# EAGLE design class-d-amp-3-5-mm (EAGLE 5.10)
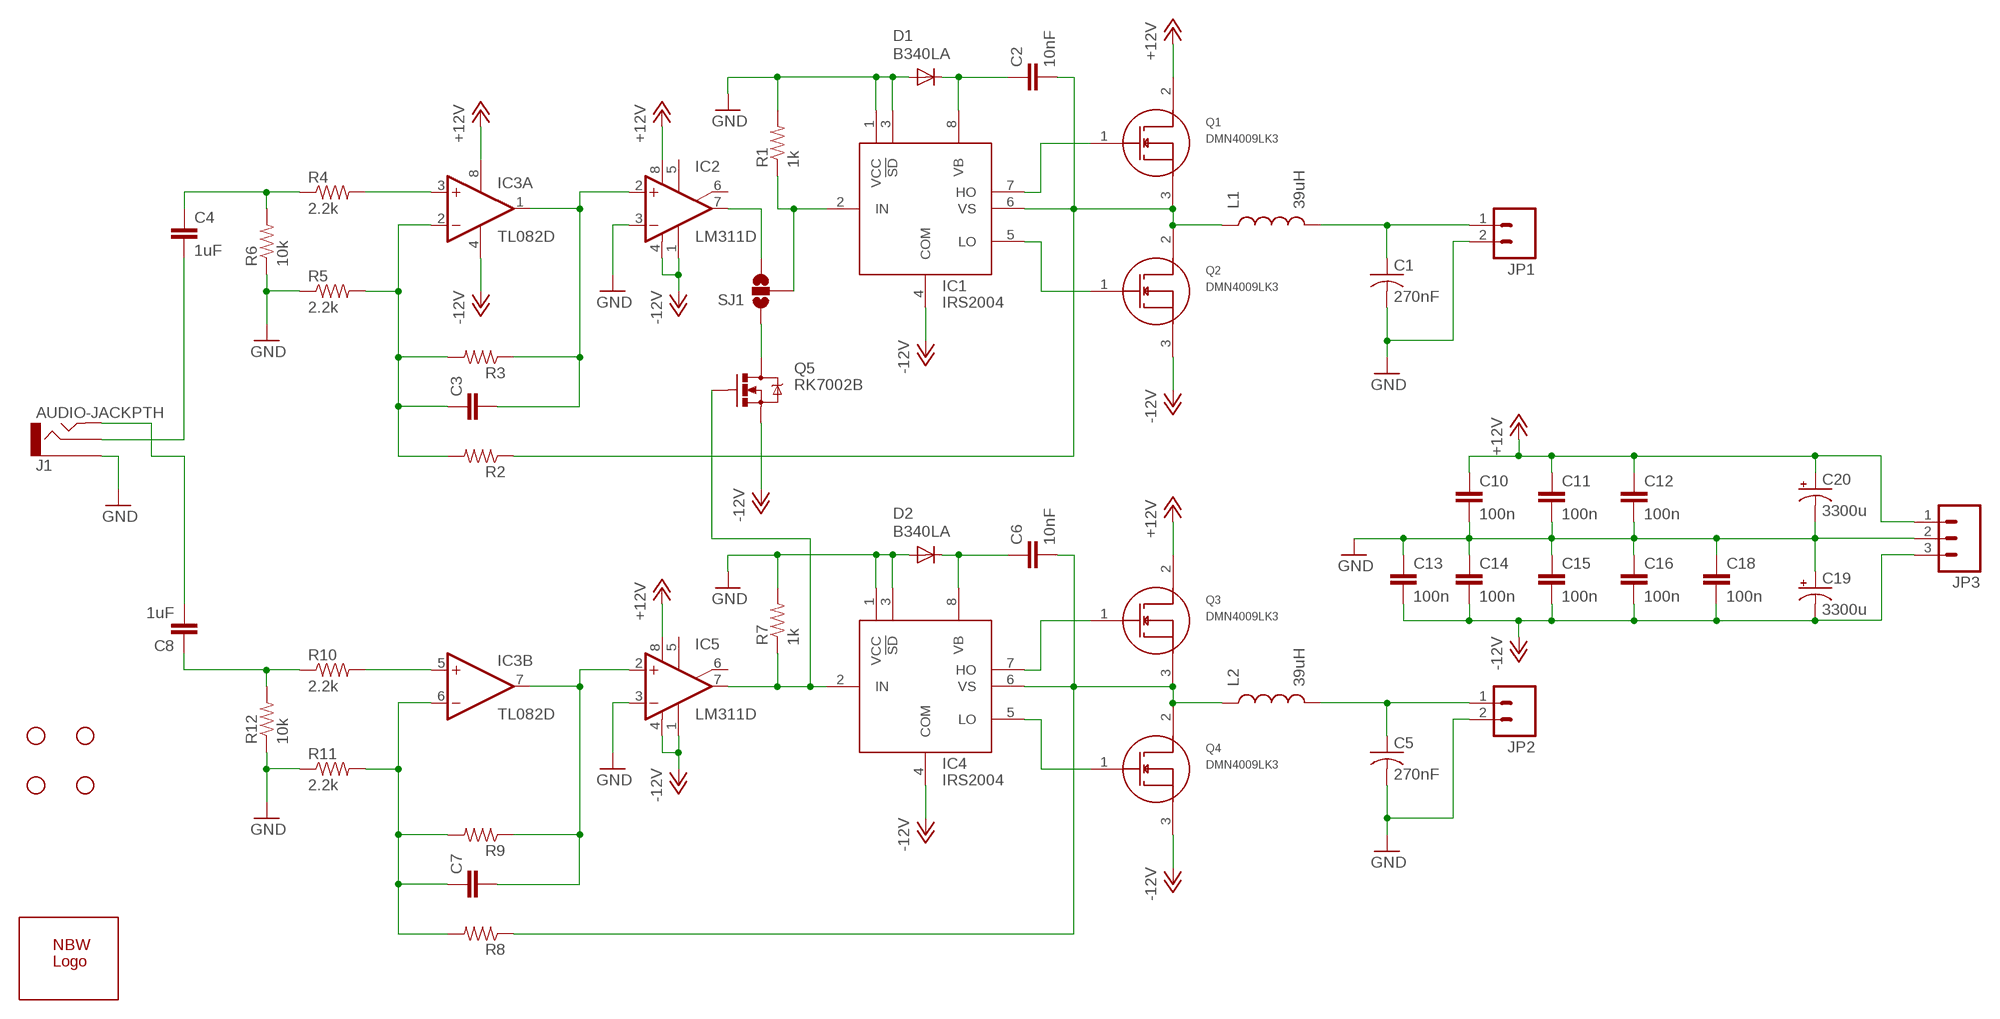
[diagram p0: schematic, sheet 1]

## Parts
C1  270nF  C-USC1210  [C1210]
C2  10nF  CAP0603  [0603]
C3  CAP0603  [0603]
C4  1uF  CAP0603  [0603]
C5  270nF  C-USC1210  [C1210]
C6  10nF  CAP0603  [0603]
C7  CAP0603  [0603]
C8  1uF  CAP0603  [0603]
C10  100n  CAP0603  [0603]
C11  100n  CAP0603  [0603]
C12  100n  CAP0603  [0603]
C13  100n  CAP0603  [0603]
C14  100n  CAP0603  [0603]
C15  100n  CAP0603  [0603]
C16  100n  CAP0603  [0603]
C18  100n  CAP0603  [0603]
C19  3300u  CPOL-USE7.5-16  [E7,5-16]
C20  3300u  CPOL-USE7.5-16  [E7,5-16]
D1  B340LA  DIODESMA  [SMA-DIODE]
D2  B340LA  DIODESMA  [SMA-DIODE]
IC1  IRS2004  IR2302  [SO-08]
IC2  LM311D  [SO08]
IC3  TL082D  [SO08]
IC4  IRS2004  IR2302  [SO-08]
IC5  LM311D  [SO08]
J1  AUDIO-JACKPTH  [AUDIO-JACK]
JP1  M02PTH  [1X02]
JP2  M02PTH  [1X02]
JP3  M03PTH  [1X03]
L1  39uH  INDUCTORPWR  [CDRH125]
L2  39uH  INDUCTORPWR  [CDRH125]
Q1  DMN4009LK3  [TO252-3L]
Q2  DMN4009LK3  [TO252-3L]
Q3  DMN4009LK3  [TO252-3L]
Q4  DMN4009LK3  [TO252-3L]
Q5  RK7002B  MOSFET-NCHANNELSMD  [SOT23-3]
R1  1k  RESISTOR0603  [0603]
R2  RESISTOR0603  [0603]
R3  RESISTOR0603  [0603]
R4  2.2k  RESISTOR0603  [0603]
R5  2.2k  RESISTOR0603  [0603]
R6  10k  RESISTOR0603  [0603]
R7  1k  RESISTOR0603  [0603]
R8  RESISTOR0603  [0603]
R9  RESISTOR0603  [0603]
R10  2.2k  RESISTOR0603  [0603]
R11  2.2k  RESISTOR0603  [0603]
R12  10k  RESISTOR0603  [0603]
SJ1  SOLDERJUMPER_2WAYS  [SJ_3]
U$1  STAND-OFF  [STAND-OFF]
U$2  STAND-OFF  [STAND-OFF]
U$3  STAND-OFF  [STAND-OFF]
U$4  STAND-OFF  [STAND-OFF]
U$5  NBW_LOGOSMALL  [NBW_LOGO]

## Nets
+12V: C10.1 C11.1 C12.1 C20.+ IC2.8(V+) IC3.8(P:V+) IC5.8(V+) JP3.1 Q1.2 Q3.2
-12V: C13.2 C14.2 C15.2 C16.2 C18.2 C19.- IC1.4(COM) IC2.1(GND) IC2.4(V-) IC3.4(P:V-) IC4.4(COM) IC5.1(GND) IC5.4(V-) JP3.3 Q2.3 Q4.3 Q5.2(S)
GND: C1.2 C5.2 C10.2 C11.2 C12.2 C13.1 C14.1 C15.1 C16.1 C18.1 C19.+ C20.- D1.A D2.A IC1.1(VCC) IC1.3(!SD) IC2.3(-IN) IC4.1(VCC) IC4.3(!SD) IC5.3(-IN) J1.1 JP1.2 JP2.2 JP3.2 R1.2 R5.1 R6.1 R7.2 R11.1 R12.1
N$1: C1.1 JP1.1 L1.2
N$2: C3.2 IC2.2(+IN) IC3.1(A:OUT) R3.1
N$3: IC3.3(A:+IN) R4.2
N$4: IC1.7(HO) Q1.1
N$5: IC1.5(LO) Q2.1
N$6: IC1.2(IN) R1.1 SJ1.2
N$7: C2.1 D1.C IC1.8(VB)
N$8: C3.1 IC3.2(A:-IN) R2.2 R3.2 R5.2
N$9: C2.2 IC1.6(VS) L1.1 Q1.3 Q2.2 R2.1
N$10: C4.1 R4.1 R6.2
N$11: C5.1 JP2.1 L2.2
N$12: IC4.7(HO) Q3.1
N$13: IC4.5(LO) Q4.1
N$14: C7.2 IC3.7(B:OUT) IC5.2(+IN) R9.1
N$15: IC4.2(IN) IC5.7(OUT) Q5.1(G) R7.1
N$16: C6.1 D2.C IC4.8(VB)
N$17: C7.1 IC3.6(B:-IN) R8.2 R9.2 R11.2
N$18: C6.2 IC4.6(VS) L2.1 Q3.3 Q4.2 R8.1
N$19: IC3.5(B:+IN) R10.2
N$20: C8.1 R10.1 R12.2
N$21: C4.2 J1.2
N$22: C8.2 J1.5
N$23: IC2.7(OUT) SJ1.3
N$25: Q5.3(D) SJ1.1
Unconnected: IC2.5(ON) IC2.6(ON/STR) IC5.5(ON) IC5.6(ON/STR)

## Library data of the parts
C1 C5 = rcl:C-US: CAPACITOR, American symbol
C2-C4 C6-C8 C10-C16 C18 = SparkFun:CAP: Capacitor Standard 0603 ceramic capacitor, and 0.1" leaded capacitor.
C19 C20 = rcl:CPOL-US: POLARIZED CAPACITOR, American symbol
D1 D2 = SparkFun:DIODE: Diode These are standard reverse protection diodes and small signal diodes. SMA package can handle up to about 1A. SOD-323 can handle about 200mA. What the SOD-323 package when ordering, there are some mfgs out there that are 5-pin packages.
IC1 IC4 = Custom:IR2302
IC2 IC5 = linear:LM311: COMPARATOR
IC3 = linear:TL082: OP AMP
J1 = SparkFun:AUDIO-JACK: 3.5mm Audio Jack Simple 3.5mm common PCB mount audio jack. SKU: PRT-08032
JP1 JP2 = SparkFun:M02: Header 2 Standard 2-pin 0.1" header. Use with straight break away headers (SKU : PRT-00116), right angle break away headers (PRT-00553), swiss pins (PRT-00743), machine pins (PRT-00117), and female headers (PRT-00115). Molex polarized connector foot print use with SKU : PRT-08233 with associated crimp pins and housings.
JP3 = SparkFun:M03: Header 3 Standard 3-pin 0.1" header. Use with straight break away headers (SKU : PRT-00116), right angle break away headers (PRT-00553), swiss pins (PRT-00743), machine pins (PRT-00117), and female headers (PRT-00115). Molex polarized connector foot print use with SKU : PRT-08232 with associated crimp pins and housings.
L1 L2 = SparkFun:INDUCTOR: Inductors Basic Inductor/Choke - 0603 and 1206. Footprints are not proven and vary greatly between part numbers.
Q1-Q4 = Custom:DMN4009LK3
Q5 = SparkFun:MOSFET-NCHANNEL
R1-R12 = SparkFun:RESISTOR: Resistor Basic schematic elements and footprints for 0603, 1206, and PTH 1/10th watt (small) resistors.
SJ1 = SparkFun:SOLDERJUMPER_2WAY: Solder Jumper 2 way solder jumper
U$1-U$4 = SparkFun:STAND-OFF: Stand Off This is the mechanical footprint for a #4 phillips button head screw. Use the keepout ring to avoid running the screw head into surrounding components. SKU : PRT-00447
U$5 = NBitWonder:NBW_LOGO

## Board
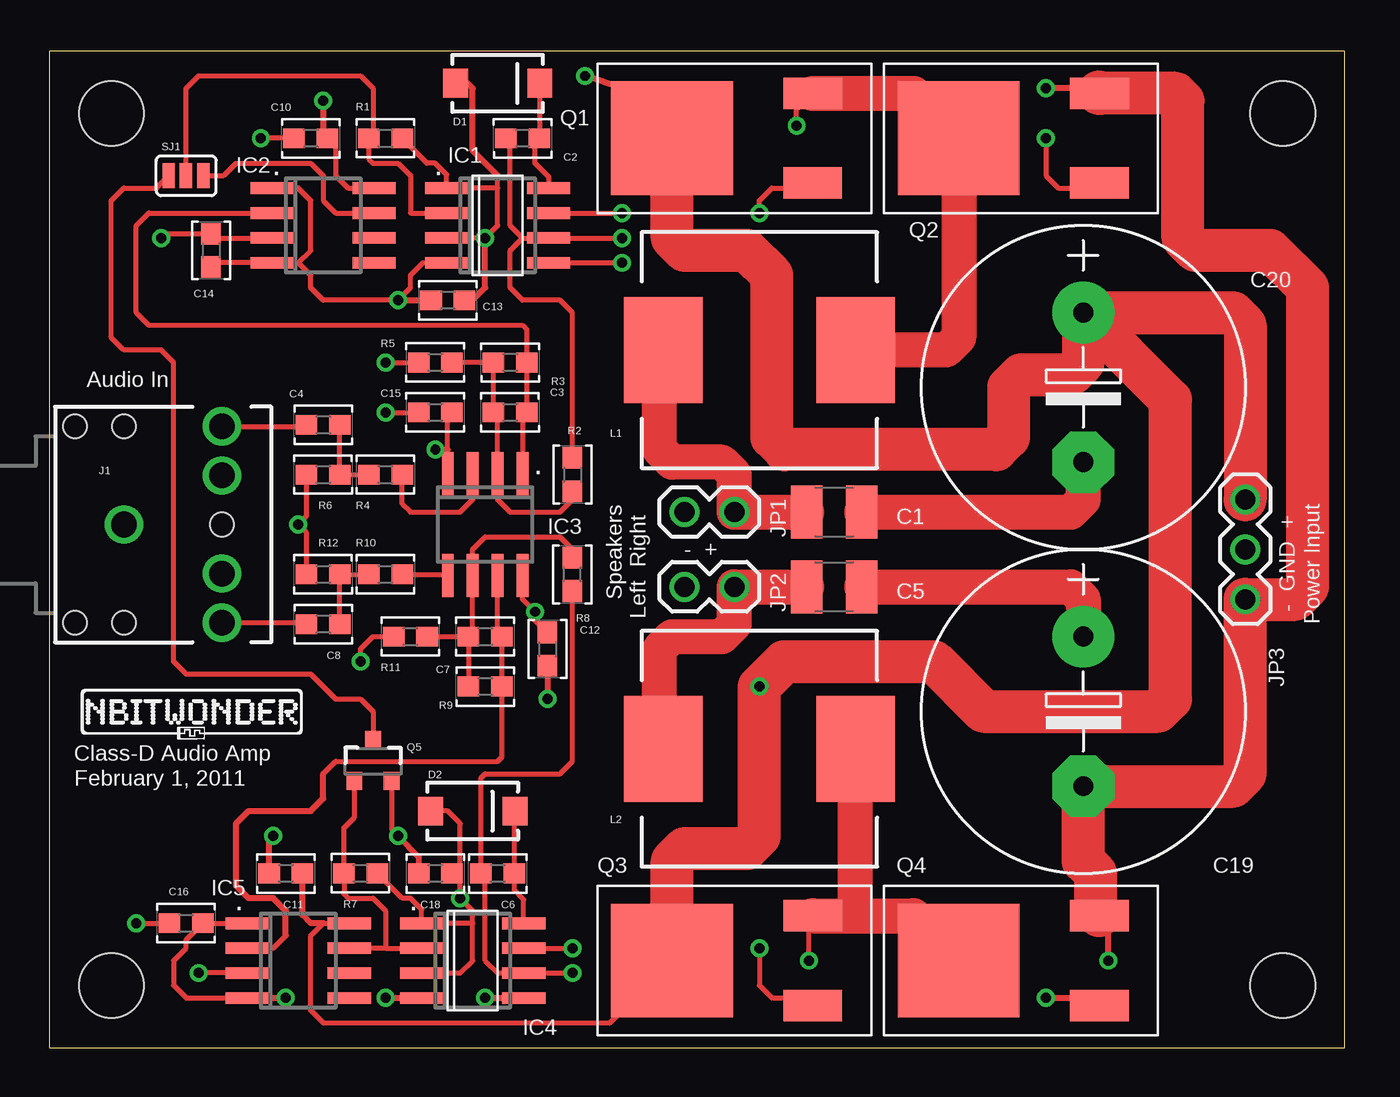
[diagram p1: board, top side]
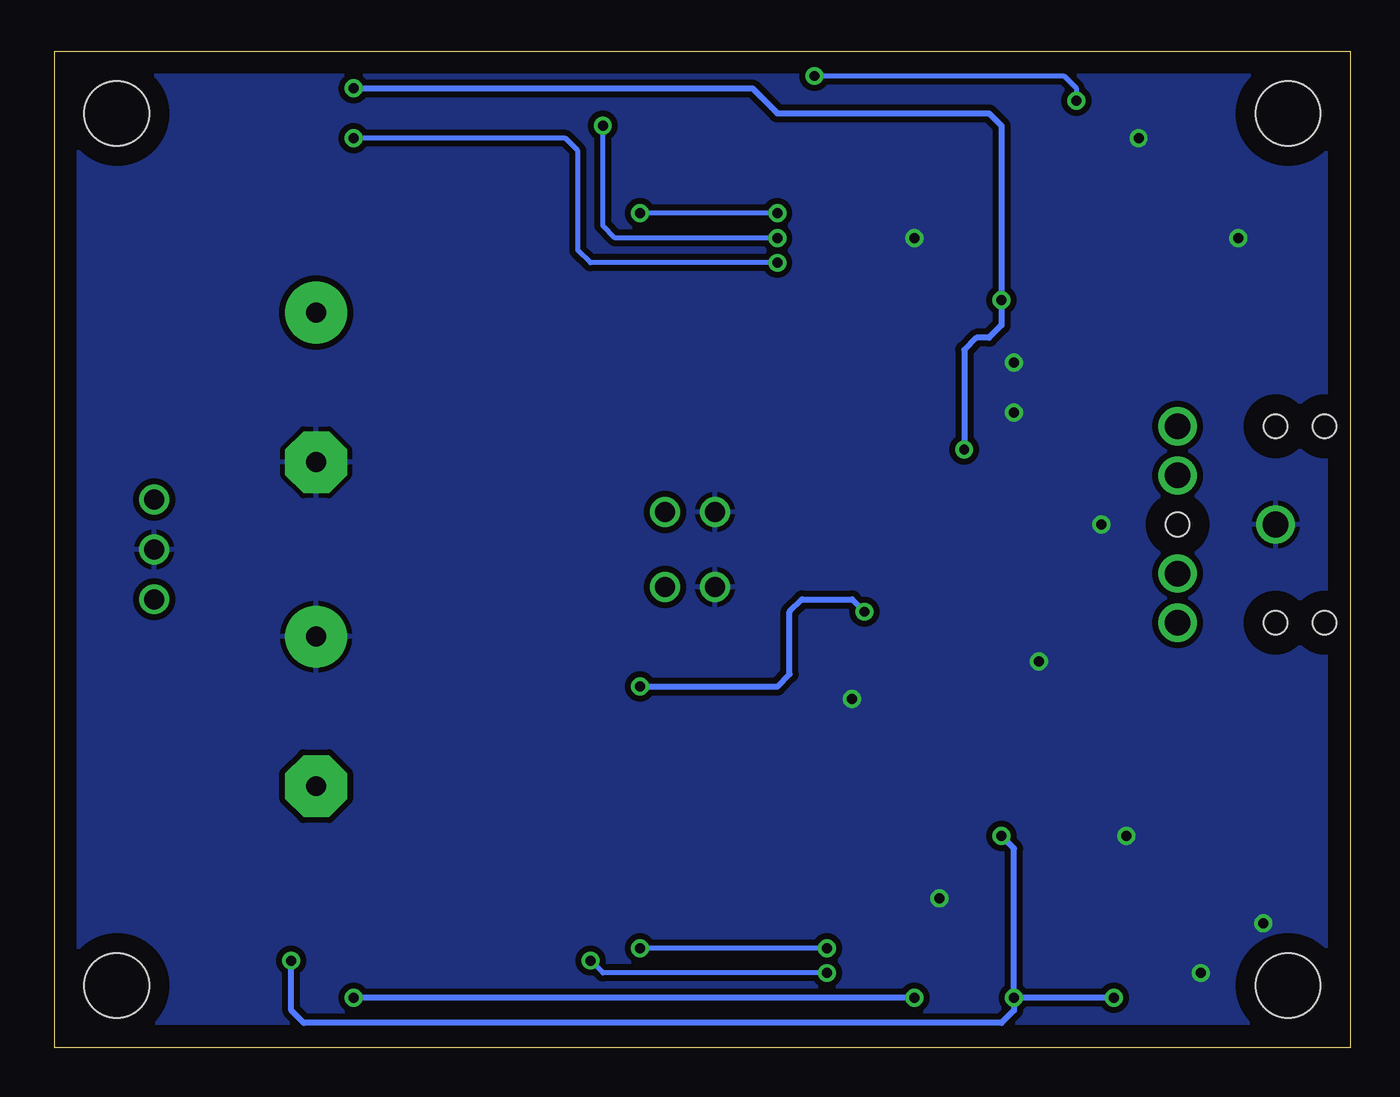
[diagram p2: board, bottom side, seen from below]

Size 66.04 x 50.8 mm. Coordinates in mm from the lower left corner, seen from the top.
Outline: 0,0 66.04,0 66.04,50.8 0,50.8 0,0
Copper layers (1*16): Top 0.035mm / dielectric 1.5mm / Bottom 0.035mm
Design rules "default *": minimum track width 10mil, minimum drill 24mil, track to track 8mil, track to pad 8mil, pad to pad 8mil, via to via 8mil, smd to smd 8mil, copper to edge 40mil, drill to drill 8mil, minimum pad ring 10mil, minimum via ring 8mil, stop-mask expansion 4mil, vias tented up to drill 20mil, thermal gap 10mil

### Footprints (pad centres in the part's own frame; a part is rotated, then mirrored left to right if it is on the bottom)
C1210 = smd 1.6 x 2.7: 1 -1.4,0; 2 1.4,0
0603 = smd 1.1 x 1: 1 -0.85,0; 2 0.85,0
E7,5-16 = drill 1.016 pad 3.15 round: + -3.81,0 | drill 1.016 pad 3.15 octagon: - 3.81,0
SMA-DIODE = smd 1.27 x 1.47: A -2.15,0; C 2.15,0
SO-08 = smd 0.6 x 2.2: 1 -1.905,-2.6; 2 -0.635,-2.6; 3 0.635,-2.6; 4 1.905,-2.6; 5 1.905,2.6; 6 0.635,2.6; 7 -0.635,2.6; 8 -1.905,2.6
SO08 = smd 0.6 x 2.2: 1 -1.905,-2.6; 2 -0.635,-2.6; 3 0.635,-2.6; 4 1.905,-2.6; 5 1.905,2.6; 6 0.635,2.6; 7 -0.635,2.6; 8 -1.905,2.6
AUDIO-JACK = drill 1.3 round: 1 0,0; 2 5,5; 3 5,2.5; 4 5,-2.5; 5 5,-5 | hole 1.2: 0,5; -2.5,5; -2.5,-5; 0,-5; 5,0
1X02 = drill 1.016 round: 1 0,0; 2 2.54,0
1X03 = drill 1.016 round: 1 0,0; 2 2.54,0; 3 5.08,0
CDRH125 = smd 5.4 x 4: 1 0,4.9; 2 0,-4.9
TO252-3L = smd 2.997 x 1.6: 1 7.163,-2.286; 3 7.163,2.286 | smd 6.198 x 5.791: 2 0,0
SOT23-3 = smd 0.8 x 0.9: 1 -0.95,-1; 2 0.95,-1; 3 0,1.1
SJ_3 = smd 0.635 x 1.27: 1 -0.889,0; 2 0,0; 3 0.889,0
STAND-OFF = hole 3.302: 0,0

### Placement (x,y rotation side)
C1  40.01,27.3 0 top
C2  24.13,46.35 180 top
C3  23.5,32.38 0 top
C4  13.97,31.75 180 top
C5  40.01,23.5 0 top
C6  22.86,8.89 180 top
C7  22.23,20.95 0 top
C8  13.97,21.59 180 top
C10  13.34,46.35 180 top
C11  12.06,8.89 180 top
C12  25.4,20.32 270 top
C13  20.32,38.1 180 top
C14  8.26,40.64 270 top
C15  19.68,32.38 0 top
C16  6.99,6.35 0 top
C18  19.68,8.89 180 top
C19  52.7,17.14 270 top
C20  52.7,33.66 270 top
D1  22.86,49.15 0 top
D2  21.59,12.06 0 top
IC1  22.86,41.91 270 top
IC2  13.97,41.91 270 top
IC3  22.23,26.67 180 top
IC4  21.59,4.45 270 top
IC5  12.7,4.45 270 top
J1  3.81,26.67 0 top
JP1  34.92,27.3 180 top
JP2  34.92,23.5 180 top
JP3  60.96,27.94 270 top
L1  36.2,35.56 270 top
L2  36.2,15.24 270 top
Q1  31.75,46.35 0 top
Q2  46.35,46.35 0 top
Q3  31.75,4.45 0 top
Q4  46.35,4.45 0 top
Q5  16.51,14.61 0 top
R1  17.14,46.35 0 top
R2  26.67,29.21 270 top
R3  23.5,34.92 180 top
R4  17.14,29.21 0 top
R5  19.68,34.92 0 top
R6  13.97,29.21 0 top
R7  15.88,8.89 0 top
R8  26.67,24.13 90 top
R9  22.23,18.41 180 top
R10  17.14,24.13 0 top
R11  18.41,20.95 0 top
R12  13.97,24.13 0 top
SJ1  6.99,44.45 0 top
U$1  3.17,3.17 0 top
U$2  3.17,47.62 0 top
U$3  62.87,3.17 0 top
U$4  62.87,47.62 0 top
U$5  1.27,15.24 0 top

### Tracks (layer width: path | path; a pad name or v marks a point on that pad's centre or on a via)
+12V  (via drill 0.51)
  Top 0.254: IC5.8 13.97,6.35 13.34,5.71 13.34,1.91 13.97,1.27 28.57,1.27 Q3.2 | IC2.8 15.24,43.81 14.61,44.45 14.61,45.94 C10.1 | IC3.8 24.13,22.86 v24.77,22.23
  Top 0.305: Q1.2 29.21,48.9 v27.3,49.53 | v13.97,48.26 13.97,46.57 C10.1 | C11.1 12.91,6.77 13.34,6.35 13.97,6.35 | v24.77,22.23 24.77,21.8 C12.1
  Top 2.184: JP3.1 60.96,36.83 60.33,37.47 C20.+ | C20.+ 52.7,34.92 52.07,34.29 49.53,34.29 48.9,33.66 48.9,31.11 48.26,30.48 37.47,30.48 36.83,31.11 36.83,39.37 35.56,40.64 32.38,40.64 31.75,41.27 Q1.2 | Q3.2 31.75,9.53 32.38,10.16 35.56,10.16 36.2,10.79 v36.2,18.41 37.47,19.68 45.09,19.68 47.62,17.14 56.52,17.14 57.15,17.78 57.15,33.02 C20.+
  Bottom 0.254: v27.3,49.53 14.61,49.53 13.97,48.9 v13.97,48.26
  Bottom 0.305: v36.2,18.41 29.21,18.41 28.57,19.05 28.57,22.23 27.94,22.86 25.4,22.86 v24.77,22.23
-12V  (via drill 0.51)
  Top 0.254: C14.2 8.47,40.01 IC2.4 12.7,40.01 | 12.7,40.01 13.34,40.64 13.34,43.18 12.7,43.81 IC2.1 | IC1.4 19.05,40.01 18.41,39.37 18.41,38.73 v17.78,38.1 13.97,38.1 13.34,38.73 13.34,39.37 12.7,40.01 | IC3.4 20.32,30.48 20.32,32.17 C15.2 | IC5.1 C16.2 6.99,5.5 6.99,5.08 6.35,4.45 6.35,3.17 6.99,2.54 IC5.4 | Q5.2 17.46,11.12 v17.78,10.79
  Top 0.305: v17.14,2.54 IC4.4 | v53.98,4.45 53.98,6.27 Q4.3 | IC5.4 v12.06,2.54 | v17.78,38.1 C13.2 | v19.68,30.48 20.32,30.48 | C18.2 18.84,9.74 v17.78,10.79 | v50.8,48.9 53.34,48.9 53.52,48.72
  Top 2.184: Q4.3 53.34,6.91 53.34,8.89 52.7,9.53 C19.- 60.33,13.34 60.96,13.97 JP3.3 63.5,22.86 64.14,23.5 64.14,38.73 62.23,40.64 58.42,40.64 57.78,41.27 57.78,48.26 57.4,48.64 53.59,48.64 | 53.59,48.64 53.52,48.72 | 53.59,48.64 Q2.3
  Bottom 0.305: v50.8,48.9 30.48,48.9 29.21,47.62 18.41,47.62 17.78,46.99 v17.78,38.1 17.78,37.47 17.78,36.83 18.41,36.2 19.05,36.2 19.68,35.56 v19.68,30.48 | v17.14,2.54 17.14,1.91 17.78,1.27 53.34,1.27 53.98,1.91 v53.98,4.45 | v12.06,2.54 v17.14,2.54 | v17.14,2.54 17.14,10.16 v17.78,10.79
GND  (via drill 0.51)
  Top 0.254: IC4.3 20.95,3.81 21.59,4.45 21.59,6.35 | 21.59,6.35 21.59,6.99 v20.95,7.62 20.95,8.47 C18.1 20.95,9.31 20.95,11.43 20.32,12.06 D2.A | 21.59,6.35 IC4.1 18.99,7.04 18.41,7.62 18,7.62 R7.2 | IC1.3 v22.23,41.27 22.86,41.91 22.86,43.81 | 22.86,43.81 22.86,44.45 | 22.86,43.81 IC1.1 20.26,44.51 19.68,45.09 19.27,45.09 R1.2 | R6.1 13.12,27.09 v12.7,26.67 13.12,26.25 R12.1 | IC5.3 v7.62,3.81 | R11.1 16.51,20.95 15.88,20.32 v15.88,19.68 | IC2.3 8.47,41.27 C14.1 5.93,41.49 v5.71,41.27 | C10.2 v10.79,46.35 | v17.14,34.92 R5.1 | v17.14,32.38 C15.1 | v4.45,6.35 C16.1
  Top 0.305: C12.2 v25.4,17.78 | C11.2 11.21,10.58 v11.43,10.79 | D1.A 21.33,49.15 21.59,48.9 21.59,45.72 22.86,44.45 | C13.1 21.59,38.1 22.23,38.73 v22.23,41.27
  Top 1.778: C1.2 52.07,27.3 52.7,27.94 C20.- | C5.2 52.07,23.5 52.7,22.86 C19.+
  pour Bottom (isolate 0.305): 1.27,1.27 64.77,1.27 64.77,49.53 1.27,49.53
N$1
  Top 1.778: L1.2 31.11,35.38 31.11,30.48 31.75,29.84 34.29,29.84 34.92,29.21 JP1.1 C1.1
N$2
  Top 0.254: IC3.1 24.13,32.17 C3.2 R3.1 24.34,36.62 24.13,36.83 5.08,36.83 4.45,37.47 4.45,41.91 5.08,42.55 IC2.2
N$3
  Top 0.254: R4.2 18,27.73 18.41,27.3 20.95,27.3 21.59,27.94 IC3.3
N$4  (via drill 0.51)
  Top 0.254: IC1.7 v29.21,42.55 | v36.2,42.55 36.2,43.18 36.83,43.81 38.66,43.81 Q1.1
  Bottom 0.254: v29.21,42.55 v36.2,42.55
N$5  (via drill 0.51)
  Top 0.254: IC1.5 v29.21,40.01 | v50.8,46.35 50.8,44.45 51.44,43.81 53.26,43.81 Q2.1
  Bottom 0.254: v29.21,40.01 38.73,40.01 39.37,40.64 39.37,45.72 40.01,46.35 v50.8,46.35
N$6
  Top 0.254: IC1.2 18.41,42.55 18.41,44.45 17.78,45.09 16.51,45.09 16.3,45.3 R1.1 16.51,46.57 16.51,48.9 15.88,49.53 7.62,49.53 6.99,48.9 SJ1.2
N$7
  Top 0.254: D1.C 25.01,46.38 C2.1 24.77,46.14 24.77,45.09 25.46,44.39 IC1.8
N$8
  Top 0.254: R2.2 26.67,27.94 26.04,27.3 23.5,27.3 22.86,27.94 IC3.2 22.86,32.17 C3.1 R3.2 R5.2
N$9  (via drill 0.51)
  Top 0.254: v29.21,41.27 IC1.6 24.13,41.27 | v38.1,46.99 38.1,47.83 Q1.3 | 24.13,41.27 23.5,41.91 23.5,46.14 C2.2 | R2.1 26.67,37.47 26.04,38.1 24.13,38.1 23.5,38.73 23.5,40.64 24.13,41.27
  Top 1.778: Q1.3 44.07,48.64 Q2.2 46.35,36.2 45.72,35.56 L1.1
  Bottom 0.254: v29.21,41.27 37.47,41.27 38.1,41.91 v38.1,46.99
N$10
  Top 0.254: C4.1 R6.2 R4.1
N$11
  Top 1.778: L2.2 31.11,15.42 31.11,20.32 31.75,20.95 34.29,20.95 34.92,21.59 JP2.1 C5.1
N$12  (via drill 0.51)
  Top 0.254: IC4.7 v26.67,5.08 | v36.2,5.08 36.2,3.17 36.83,2.54 38.53,2.54 Q3.1
  Bottom 0.254: v26.67,5.08 v36.2,5.08
N$13  (via drill 0.51)
  Top 0.305: v22.23,2.54 IC4.5 | v50.8,2.54 53.14,2.54 Q4.1
  Bottom 0.305: v22.23,2.54 v50.8,2.54
N$14
  Top 0.254: IC3.7 22.86,21.17 C7.2 R9.1 23.07,14.82 22.86,14.61 14.61,14.61 13.97,13.97 | 12.06,5.71 11.43,5.08 IC5.2
  Top 0.305: 12.06,5.71 12.06,6.99 11.43,7.62 10.16,7.62 9.53,8.26 9.53,11.43 10.16,12.06 13.34,12.06 13.97,12.7 13.97,13.97
N$15
  Top 0.254: 17.14,5.08 IC5.7 | 17.14,5.08 IC4.2 | 17.14,5.08 17.14,6.99 16.51,7.62 15.24,7.62 15.03,7.83 R7.1 15.03,11.21 15.56,11.75 Q5.1
N$16
  Top 0.254: IC4.8 24.19,7.56 23.71,8.04 C6.1 23.71,12.04 D2.C
N$17
  Top 0.254: C7.1 21.59,21.17 IC3.6 21.59,25.4 22.23,26.04 26.04,26.04 26.67,25.4 R8.2 | C7.1 R9.2 | R11.2 C7.1
N$18  (via drill 0.51)
  Top 0.254: v26.67,3.81 IC4.6 22.86,3.81 22.23,4.45 22.23,8.68 C6.2 22.01,13.76 22.23,13.97 26.04,13.97 26.67,14.61 R8.1 | v38.73,4.45 38.73,6.55 Q3.3
  Top 1.778: Q3.3 41.27,6.73 | 41.27,6.73 44.07,6.73 Q4.2 | L2.1 41.09,6.91 41.27,6.73
  Bottom 0.254: v26.67,3.81 38.1,3.81 v38.73,4.45
N$19
  Top 0.254: R10.2 20.26,24.13 IC3.5
N$20
  Top 0.254: C8.1 R12.2 R10.1
N$21
  Top 0.254: J1.2 13.04,31.67 C4.2
N$22
  Top 0.254: J1.5 13.04,21.67 C8.2
N$23
  Top 0.254: IC2.7 14.61,42.55 13.97,43.18 13.97,44.45 13.34,45.09 9.53,45.09 8.89,44.45 SJ1.3
N$25
  Top 0.254: Q5.3 16.51,17.14 15.88,17.78 14.61,17.78 13.34,19.05 6.99,19.05 6.35,19.68 6.35,34.92 5.71,35.56 3.81,35.56 3.17,36.2 3.17,43.18 3.81,43.81 5.46,43.81 SJ1.1

### Text on the board
tPlace: . | . | Audio In | . | - + | Speakers | Left Right | - GND + | Power Input | Class-D Audio Amp | February 1, 2011 | . | .